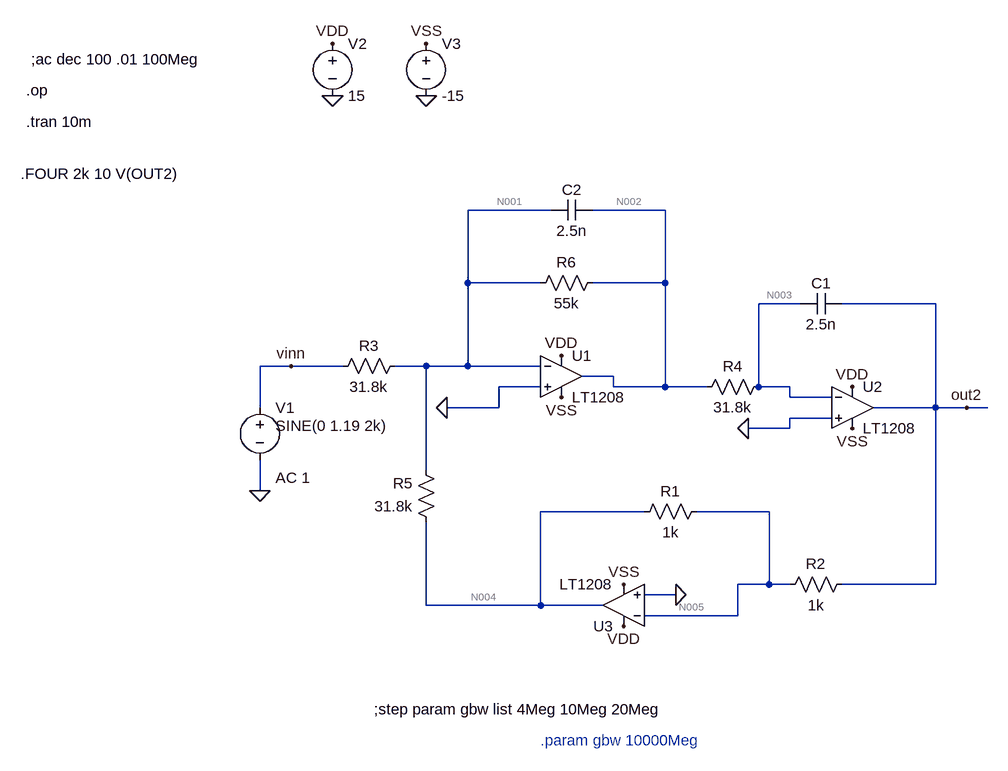
[diagram p0: schematic Etaj 2.asc]
Etaj 2.asc, the LTspice schematic file:
Version 4
SHEET 1 880 680
WIRE 16 -256 -112 -256
WIRE 192 -256 80 -256
WIRE -112 -144 -112 -256
WIRE 0 -144 -112 -144
WIRE 192 -144 192 -256
WIRE 192 -144 80 -144
WIRE 400 -112 336 -112
WIRE 608 -112 464 -112
WIRE -384 -16 -432 -16
WIRE -304 -16 -384 -16
WIRE -176 -16 -224 -16
WIRE -112 -16 -112 -144
WIRE -112 -16 -176 -16
WIRE 0 -16 -112 -16
WIRE 112 0 64 0
WIRE 0 16 -64 16
WIRE 112 16 112 0
WIRE 192 16 192 -144
WIRE 192 16 112 16
WIRE 256 16 192 16
WIRE 336 16 336 -112
WIRE 384 16 336 16
WIRE 384 32 384 16
WIRE 448 32 384 32
WIRE -432 48 -432 -16
WIRE -64 48 -64 16
WIRE -64 48 -144 48
WIRE 608 48 608 -112
WIRE 608 48 512 48
WIRE 656 48 608 48
WIRE 688 48 656 48
WIRE 448 64 384 64
WIRE 384 80 384 64
WIRE 384 80 320 80
WIRE -176 144 -176 -16
WIRE -432 176 -432 128
WIRE 160 208 0 208
WIRE 352 208 240 208
WIRE 352 320 352 208
WIRE 352 320 304 320
WIRE 384 320 352 320
WIRE 608 320 608 48
WIRE 608 320 464 320
WIRE 208 336 160 336
WIRE -176 352 -176 224
WIRE 0 352 0 208
WIRE 0 352 -176 352
WIRE 96 352 0 352
WIRE 304 368 304 320
WIRE 304 368 160 368
FLAG -432 176 0
FLAG 656 48 out2
FLAG -144 48 0
FLAG 320 80 0
FLAG 128 320 VSS
FLAG 128 384 VDD
FLAG 32 -32 VDD
FLAG 480 16 VDD
FLAG 32 32 VSS
FLAG 480 80 VSS
FLAG 208 336 0
FLAG -384 -16 vinn
FLAG -320 -432 0
FLAG -176 -432 0
FLAG -320 -512 VDD
FLAG -176 -512 VSS
SYMBOL cap 464 -128 R90
WINDOW 0 0 32 VBottom 2
WINDOW 3 32 32 VTop 2
SYMATTR InstName C1
SYMATTR Value 2.5n
SYMBOL res 256 192 R90
WINDOW 0 0 56 VBottom 2
WINDOW 3 32 56 VTop 2
SYMATTR InstName R1
SYMATTR Value 1k
SYMBOL res 480 304 R90
WINDOW 0 0 56 VBottom 2
WINDOW 3 32 56 VTop 2
SYMATTR InstName R2
SYMATTR Value 1k
SYMBOL voltage -432 32 R0
WINDOW 123 24 124 Left 2
WINDOW 39 0 0 Left 2
WINDOW 3 24 44 Left 2
SYMATTR Value2 AC 1
SYMATTR Value SINE(0 1.19 2k)
SYMATTR InstName V1
SYMBOL res -208 -32 R90
WINDOW 0 0 56 VBottom 2
WINDOW 3 32 56 VTop 2
SYMATTR InstName R3
SYMATTR Value 31.8k
SYMBOL res 352 0 R90
WINDOW 0 0 56 VBottom 2
WINDOW 3 32 56 VTop 2
SYMATTR InstName R4
SYMATTR Value 31.8k
SYMBOL res -160 240 R180
WINDOW 0 36 76 Left 2
WINDOW 3 36 40 Left 2
SYMATTR InstName R5
SYMATTR Value 31.8k
SYMBOL res 96 -160 R90
WINDOW 0 0 56 VBottom 2
WINDOW 3 32 56 VTop 2
SYMATTR InstName R6
SYMATTR Value 55k
SYMBOL cap 80 -272 R90
WINDOW 0 0 32 VBottom 2
WINDOW 3 32 32 VTop 2
SYMATTR InstName C2
SYMATTR Value 2.5n
SYMBOL OpAmps\\LT1208 32 -64 R0
SYMATTR InstName U1
SYMBOL OpAmps\\LT1208 480 -16 R0
SYMATTR InstName U2
SYMBOL OpAmps\\LT1208 128 416 R180
SYMATTR InstName U3
SYMBOL voltage -320 -528 R0
WINDOW 123 0 0 Left 0
WINDOW 39 0 0 Left 0
SYMATTR InstName V2
SYMATTR Value 15
SYMBOL voltage -176 -528 R0
WINDOW 123 0 0 Left 0
WINDOW 39 0 0 Left 0
SYMATTR InstName V3
SYMATTR Value -15
TEXT 0 560 Left 2 ;.param gbw 10000Meg
TEXT -256 512 Left 2 !;step param gbw list 4Meg 10Meg 20Meg
TEXT -784 -488 Left 2 !;ac dec 100 .01 100Meg
TEXT -792 -440 Left 2 !.op
TEXT -792 -392 Left 2 !.tran 10m
TEXT -800 -312 Left 2 !.FOUR 2k 10 V(OUT2)

The netlist it stands for:
* Etaj 2.asc
C1 out2 N003 2.5n
R1 N005 N004 1k
R2 out2 N005 1k
V1 vinn 0 SINE(0 1.19 2k) AC 1
R3 N001 vinn 31.8k
R4 N003 N002 31.8k
R5 N004 N001 31.8k
R6 N002 N001 55k
C2 N002 N001 2.5n
XU1 0 N001 VDD VSS N002 LT1208  ; pins In+ In- V+ V- OUT
XU2 0 N003 VDD VSS out2 LT1208  ; pins In+ In- V+ V- OUT
XU3 0 N005 VDD VSS N004 LT1208  ; pins In+ In- V+ V- OUT
V2 VDD 0 15
V3 VSS 0 -15
* .param gbw 10000Meg
;step param gbw list 4Meg 10Meg 20Meg
;ac dec 100 .01 100Meg
.op
.tran 10m
.FOUR 2k 10 V(OUT2)
.backanno
.end

* Results of the author's LTspice run, read from the files saved beside the schematic
* Operating Point, zero values left out:
*   V(out2) = -49.62 mV
*   V(n003) = 7.324 µV
*   V(n005) = -7.926 µV
*   V(n004) = 53.6 mV
*   V(n001) = -17.84 µV
*   V(n002) = 127.2 mV
*   V(vdd) = 15 V
*   V(vss) = -15 V
*   I(R1) = -53.61 µA
*   I(R2) = -49.61 µA
*   I(R3) = -561 pA
*   I(R4) = -4 µA
*   I(R5) = 1.686 µA
*   I(R6) = 2.313 µA
*   I(V1) = -561 pA
*   I(V2) = -21 mA
*   I(V3) = 21.01 mA
*   Ix(u1:1) = 4 µA
*   Ix(u1:2) = 4 µA
*   Ix(u1:3) = 7 mA
*   Ix(u1:4) = -7.002 mA
*   Ix(u1:5) = -6.313 µA
*   Ix(u2:1) = 4 µA
*   Ix(u2:2) = 4 µA
*   Ix(u2:3) = 6.972 mA
*   Ix(u2:4) = -7.03 mA
*   Ix(u2:5) = 49.61 µA
*   Ix(u3:1) = 4 µA
*   Ix(u3:2) = 4 µA
*   Ix(u3:3) = 7.025 mA
*   Ix(u3:4) = -6.978 mA
*   Ix(u3:5) = -55.3 µA
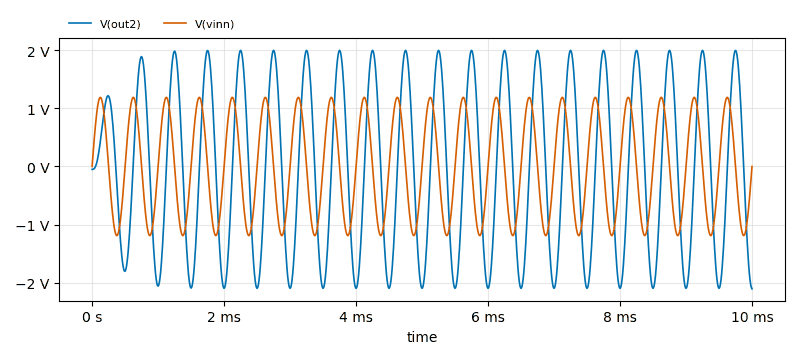
[diagram p1: Transient Analysis of Etaj 2.asc, plotted from the saved traces]
* Transient Analysis, 1 run:
*   V(out2): min -2.106 V, max 1.999 V, average -40.13 mV, rms 1.422 V, last -2.106 V
*   V(vinn): min -1.19 V, max 1.19 V, average -399.2 nV, rms 841.5 mV, last 0 V
* From the log:
*   N-Period=1
*   Fourier components of V(out2)
*   DC component:-0.0496991
*   Harmonic  Frequency   Fourier   Normalized   Phase    Normalized
*    Number     [Hz]     Component   Component  [degree]  Phase [deg]
*       1      2.000e+3   2.046e+0   1.000e+0   -179.88°      0.00°
*       2      4.000e+3   2.054e-4   1.004e-4    177.20°    357.08°
*       3      6.000e+3   1.904e-4   9.309e-5    174.81°    354.68°
*       4      8.000e+3   1.918e-4   9.375e-5    171.29°    351.17°
*       5      1.000e+4   1.949e-4   9.526e-5    168.68°    348.56°
*       6      1.200e+4   1.900e-4   9.287e-5    166.88°    346.75°
*       7      1.400e+4   1.841e-4   8.999e-5    164.16°    344.03°
*       8      1.600e+4   1.853e-4   9.059e-5    161.10°    340.98°
*       9      1.800e+4   1.865e-4   9.118e-5    159.15°    339.03°
*      10      2.000e+4   1.812e-4   8.856e-5    157.17°    337.05°
*   Partial Harmonic Distortion: 0.027873%
*   Total Harmonic Distortion:   0.075256%